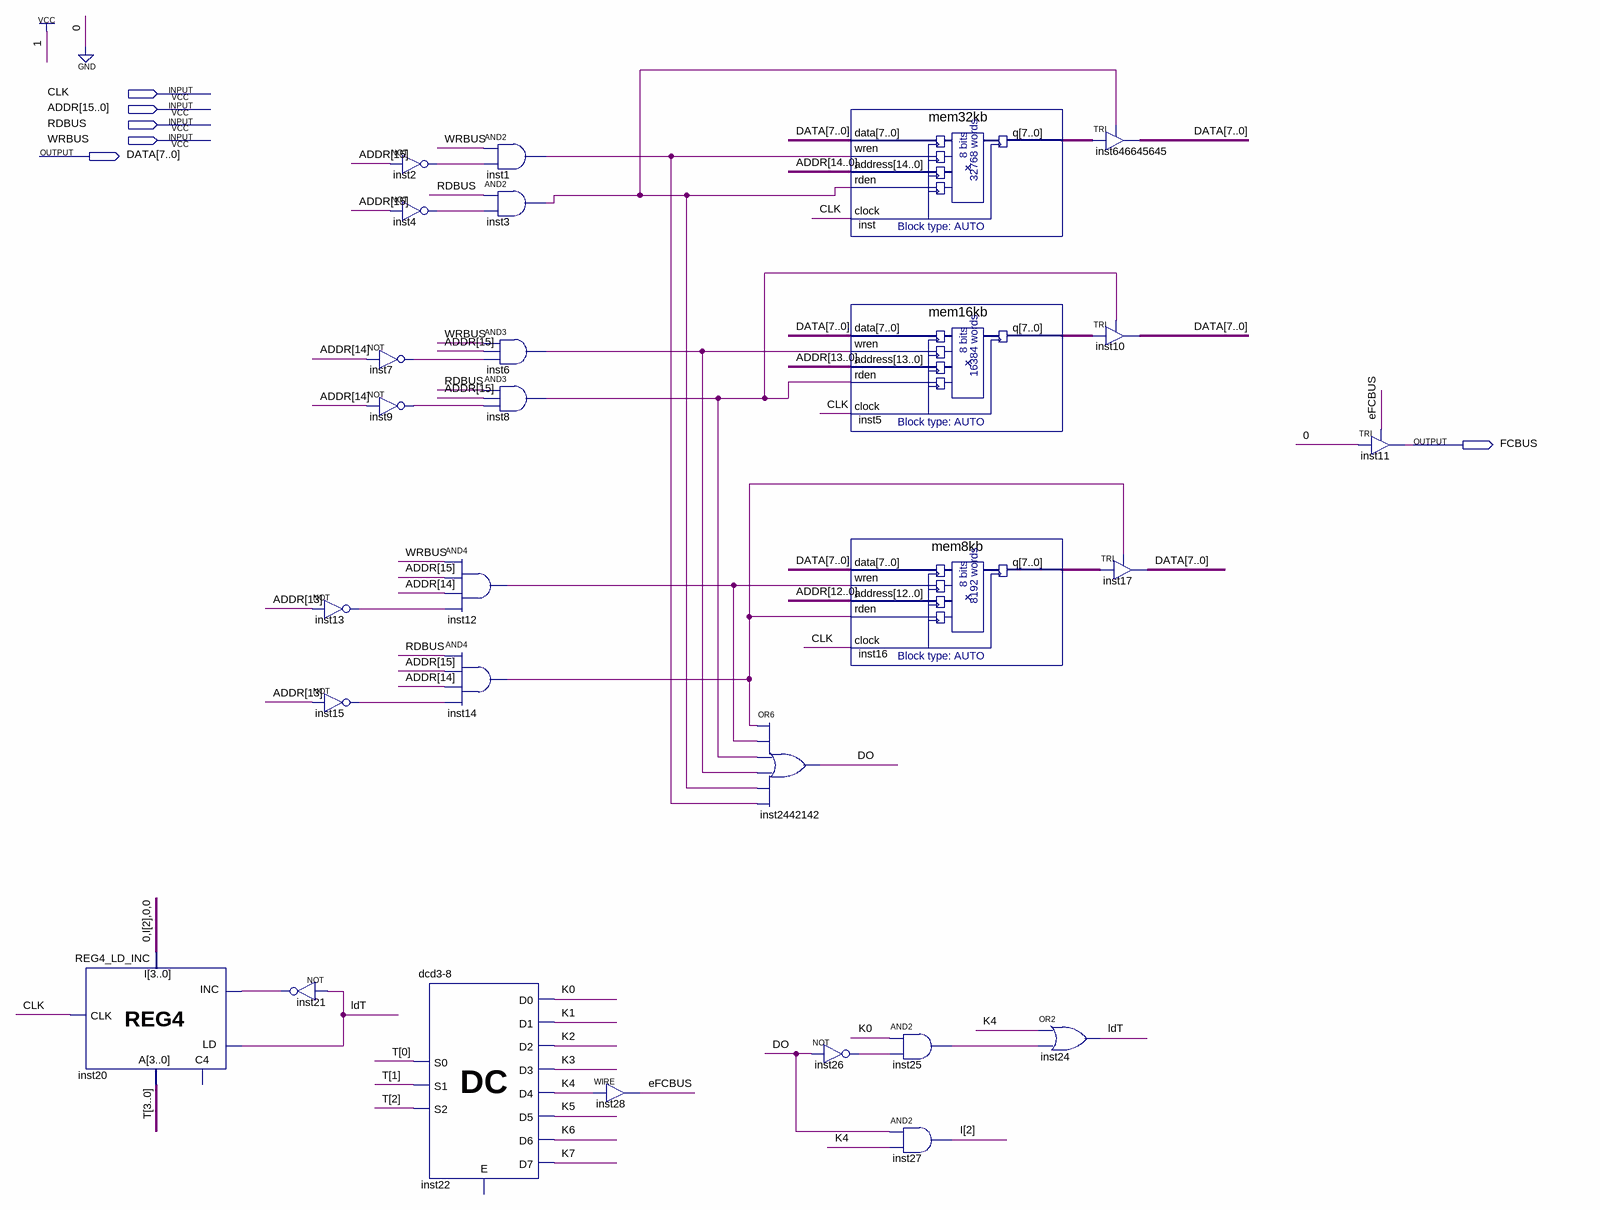
[diagram p0: schematic sheet]
// Quartus schematic RAM.bdf as structural Verilog: 28 symbols, 6 pins
module RAM (
  input  CLK,
  input  [15:0] ADDR,
  input  RDBUS,
  input  WRBUS,
  output [7:0] DATA,
  output FCBUS
);

  wire DO, eFCBUS, inst1_out, inst2_out, inst3_out, inst4_out, inst6_out, inst7_out, inst8_out, inst9_out,
       inst12_out, inst13_out, inst14_out, inst15_out, inst21_out, inst25_out, inst26_out, K0, K1, K2, K3,
       K4, K5, K6, K7, ldT;
  wire [2:2] I;
  wire [3:0] T;
  wire [7:0] inst5_q, inst16_q, inst_q;

  REG4_LD_INC inst20 (.LD(ldT), .INC(inst21_out), .CLK(CLK), .I({1'b0, I[2], 2'b00}), .A(T));  // open: C4
  not inst13 (inst13_out, ADDR[13]);
  not inst15 (inst15_out, ADDR[13]);
  not inst21 (inst21_out, ldT);
  not inst7 (inst7_out, ADDR[14]);
  not inst9 (inst9_out, ADDR[14]);
  not inst2 (inst2_out, ADDR[15]);
  not inst4 (inst4_out, ADDR[15]);
  and inst12 (inst12_out, WRBUS, ADDR[15], ADDR[14], inst13_out);
  and inst14 (inst14_out, RDBUS, ADDR[15], ADDR[14], inst15_out);
  \dcd3-8  inst22 (
    .S0(T[0]), .S1(T[1]), .S2(T[2]), .D0(K0), .D1(K1), .D2(K2), .D3(K3), .D4(K4), .D5(K5), .D6(K6), .D7(K7));  // open: E
  and inst1 (inst1_out, WRBUS, inst2_out);
  and inst3 (inst3_out, RDBUS, inst4_out);
  and inst6 (inst6_out, WRBUS, ADDR[15], inst7_out);
  and inst8 (inst8_out, RDBUS, ADDR[15], inst9_out);
  assign eFCBUS = K4;  // WIRE inst28
  or inst2442142 (DO, inst14_out, inst12_out, inst8_out, inst6_out, inst3_out, inst1_out);
  not inst26 (inst26_out, DO);
  mem32kb inst (.data(DATA), .wren(inst1_out), .address(ADDR[14:0]), .rden(inst3_out), .clock(CLK), .q(inst_q));
  mem16kb inst5 (.data(DATA), .wren(inst6_out), .address(ADDR[13:0]), .rden(inst8_out), .clock(CLK), .q(inst5_q));
  mem8kb inst16 (.data(DATA), .wren(inst12_out), .address(ADDR[12:0]), .rden(inst14_out), .clock(CLK), .q(inst16_q));
  and inst25 (inst25_out, K0, inst26_out);
  and inst27 (I[2], DO, K4);
  or inst24 (ldT, K4, inst25_out);
  TRI inst646645645[7:0] (.IN(inst_q), .OE(inst3_out), .OUT(DATA));
  TRI inst10[7:0] (.IN(inst5_q), .OE(inst8_out), .OUT(DATA));
  TRI inst17[7:0] (.IN(inst16_q), .OE(inst14_out), .OUT(DATA));
  TRI inst11 (.IN(1'b0), .OE(eFCBUS), .OUT(FCBUS));
endmodule
